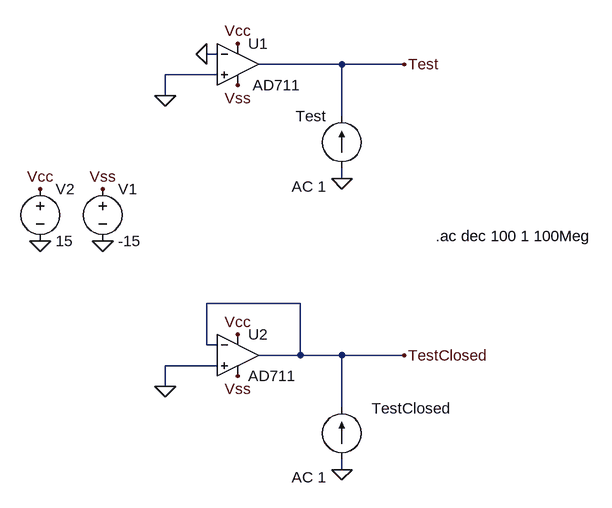
[diagram p0: schematic RoutTest.asc]
RoutTest.asc, the LTspice schematic file:
Version 4.1
SHEET 1 880 892
WIRE 160 224 144 224
WIRE 352 240 224 240
WIRE 448 240 352 240
WIRE 160 256 80 256
WIRE 80 288 80 256
WIRE 352 320 352 240
WIRE 352 416 352 400
WIRE 288 608 144 608
WIRE 144 672 144 608
WIRE 160 672 144 672
WIRE 288 688 288 608
WIRE 288 688 224 688
WIRE 352 688 288 688
WIRE 448 688 352 688
WIRE 160 704 80 704
WIRE 80 736 80 704
WIRE 352 768 352 688
WIRE 352 864 352 848
FLAG -16 512 0
FLAG -112 512 0
FLAG -112 432 Vcc
FLAG -16 432 Vss
FLAG 192 208 Vcc
FLAG 192 272 Vss
FLAG 448 240 Test
FLAG 80 288 0
FLAG 352 416 0
FLAG 144 224 0
FLAG 192 656 Vcc
FLAG 192 720 Vss
FLAG 448 688 TestClosed
FLAG 80 736 0
FLAG 352 864 0
SYMBOL OpAmps\\AD711 192 176 R0
WINDOW 3 23 96 Left 2
SYMATTR InstName U1
SYMBOL voltage -16 416 R0
SYMATTR InstName V1
SYMATTR Value -15
SYMBOL voltage -112 416 R0
SYMATTR InstName V2
SYMATTR Value 15
SYMBOL current 352 400 R180
WINDOW 0 24 80 Left 2
WINDOW 3 24 0 Left 2
WINDOW 123 24 -28 Left 2
WINDOW 39 0 0 Left 0
SYMATTR InstName Test
SYMATTR Value ""
SYMATTR Value2 AC 1
SYMBOL OpAmps\\AD711 192 624 R0
SYMATTR InstName U2
SYMBOL current 352 848 R180
WINDOW 0 -168 78 Left 2
WINDOW 3 24 0 Left 2
WINDOW 123 24 -28 Left 2
WINDOW 39 0 0 Left 0
SYMATTR InstName TestClosed
SYMATTR Value ""
SYMATTR Value2 AC 1
TEXT 496 504 Left 2 !.ac dec 100 1 100Meg

The netlist it stands for:
* RoutTest.asc
X§U1 0 0 Vcc Vss Test AD712  ; AD711, pins In+ In- V+ V- OUT
V1 Vss 0 -15
V2 Vcc 0 15
I§Test 0 Test AC 1
X§U2 0 TestClosed Vcc Vss TestClosed AD712  ; AD711, pins In+ In- V+ V- OUT
I§TestClosed 0 TestClosed AC 1
.ac dec 100 1 100Meg
.lib ADI1.lib
.backanno
.end

* Results of the author's LTspice run, read from the files saved beside the schematic
* Operating Point, zero values left out:
*   V(vcc) = 15 V
*   V(vss) = -15 V
*   I(V1) = 9.797 mA
*   I(V2) = -9.797 mA
*   Ix(u1:1) = 25 pA
*   Ix(u1:2) = 25 pA
*   Ix(u1:3) = 4.899 mA
*   Ix(u1:4) = -4.899 mA
*   Ix(u2:1) = 25 pA
*   Ix(u2:2) = 25 pA
*   Ix(u2:3) = 4.899 mA
*   Ix(u2:4) = -4.899 mA
*   Ix(u2:5) = -25 pA
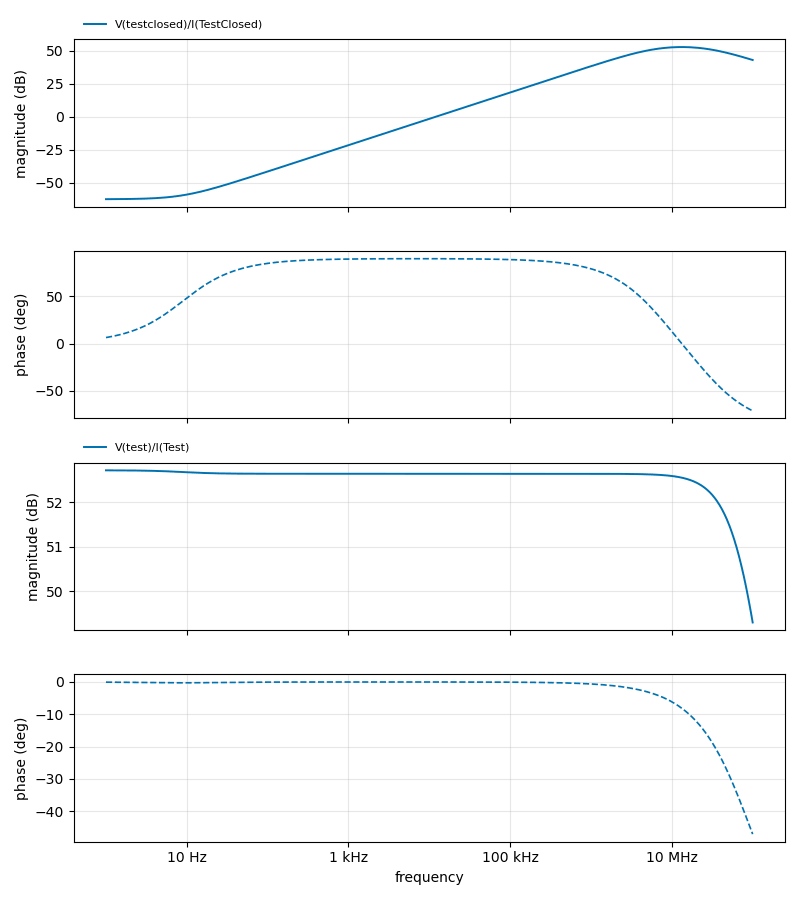
[diagram p1: AC Analysis of RoutTest.asc, plotted from the saved traces]
* AC Analysis, 1 run:
*   V(testclosed)/I(TestClosed): -62.59 dB at 1 Hz, 42.97 dB at 100 MHz, peak 52.78 dB at 13.18 MHz, 3 dB below the peak at 4.622 MHz and 38.17 MHz
*   V(test)/I(Test): 52.71 dB at 1 Hz, 49.29 dB at 100 MHz, peak 52.71 dB at 1 Hz, 3 dB below the peak at 91.25 MHz